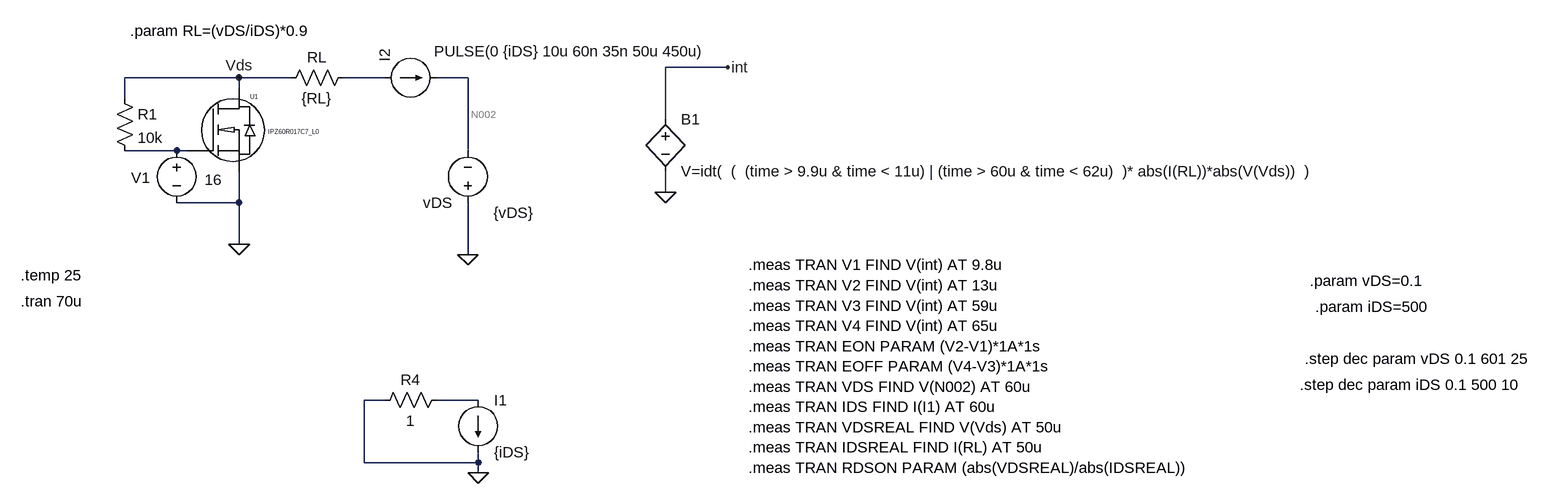
[diagram p0: schematic Eon_Eoff_circuit_reverse.asc]
Eon_Eoff_circuit_reverse.asc, the LTspice schematic file:
Version 4.1
SHEET 1 2248 708
WIRE 976 32 880 32
WIRE 224 48 48 48
WIRE 304 48 224 48
WIRE 448 48 384 48
WIRE 576 48 528 48
WIRE 224 64 224 48
WIRE 48 80 48 48
WIRE 880 112 880 32
WIRE 128 160 48 160
WIRE 144 160 128 160
WIRE 576 160 576 48
WIRE 880 224 880 192
WIRE 224 240 224 192
WIRE 224 240 128 240
WIRE 224 304 224 240
WIRE 576 320 576 240
WIRE 448 544 416 544
WIRE 592 544 528 544
WIRE 416 640 416 544
WIRE 592 640 592 624
WIRE 592 640 416 640
WIRE 592 656 592 640
FLAG 576 320 0
FLAG 224 304 0
FLAG 880 224 0
FLAG 976 32 int
FLAG 592 656 0
FLAG 224 48 Vds
SYMBOL IPx6xx_L1 144 160 R0
SYMATTR InstName U1
SYMATTR Value IPZ60R017C7_L0
SYMBOL voltage 576 256 R180
WINDOW 123 0 0 Left 0
WINDOW 39 0 0 Left 0
WINDOW 3 -101 0 Left 2
SYMATTR Value {vDS}
SYMATTR InstName vDS
SYMBOL res 400 32 R90
WINDOW 0 0 56 VBottom 2
WINDOW 3 32 56 VTop 2
SYMATTR InstName RL
SYMATTR Value {RL}
SYMBOL bv 880 96 R0
SYMATTR InstName B1
SYMATTR Value V=idt(  (  (time > 9.9u & time < 11u) | (time > 60u & time < 62u)  )* abs(I(RL))*abs(V(Vds))  )
SYMBOL current 592 544 R0
WINDOW 123 0 0 Left 0
WINDOW 39 0 0 Left 0
SYMATTR InstName I1
SYMATTR Value {iDS}
SYMBOL res 544 528 R90
WINDOW 0 0 56 VBottom 2
WINDOW 3 32 56 VTop 2
SYMATTR InstName R4
SYMATTR Value 1
SYMBOL res 32 64 R0
SYMATTR InstName R1
SYMATTR Value 10k
SYMBOL voltage 128 144 R0
WINDOW 0 -70 58 Left 2
WINDOW 3 43 61 Left 2
WINDOW 123 0 0 Left 0
WINDOW 39 0 0 Left 0
SYMATTR InstName V1
SYMATTR Value 16
SYMBOL current 448 48 R270
WINDOW 123 0 0 Left 0
WINDOW 39 0 0 Left 0
WINDOW 3 41 76 VRight 2
SYMATTR InstName I2
SYMATTR Value PULSE(0 {iDS} 10u 60n 35n 50u 450u)
TEXT 56 -24 Left 2 !.param RL=(vDS/iDS)*0.9
TEXT 1872 360 Left 2 !.param vDS=0.1
TEXT 1880 400 Left 2 !.param iDS=500
TEXT 1864 480 Left 2 !.step dec param vDS 0.1 601 25
TEXT 1856 520 Left 2 !.step dec param iDS 0.1 500 10
TEXT -112 392 Left 2 !.tran 70u
TEXT 1008 336 Left 2 !.meas TRAN V1 FIND V(int) AT 9.8u\n.meas TRAN V2 FIND V(int) AT 13u\n.meas TRAN V3 FIND V(int) AT 59u\n.meas TRAN V4 FIND V(int) AT 65u\n.meas TRAN EON PARAM (V2-V1)*1A*1s\n.meas TRAN EOFF PARAM (V4-V3)*1A*1s\n.meas TRAN VDS FIND V(N002) AT 60u\n.meas TRAN IDS FIND I(I1) AT 60u\n.meas TRAN VDSREAL FIND V(Vds) AT 50u\n.meas TRAN IDSREAL FIND I(RL) AT 50u\n.meas TRAN RDSON PARAM (abs(VDSREAL)/abs(IDSREAL))
TEXT -112 352 Left 2 !.temp 25

The netlist it stands for:
* Eon_Eoff_circuit_reverse.asc
X§U1 Vds N003 0 IPZ60R017C7_L0  ; pins drain gate source
vDS 0 N002 {vDS}
RL N001 Vds {RL}
B1 int 0 V=idt(  (  (time > 9.9u & time < 11u) | (time > 60u & time < 62u)  )* abs(I(RL))*abs(V(Vds))  )
I1 N004 0 {iDS}
R4 N004 0 1
R1 Vds N003 10k
V1 N003 0 16
I2 N001 N002 PULSE(0 {iDS} 10u 60n 35n 50u 450u)
.param RL=(vDS/iDS)*0.9
.param vDS=0.1
.param iDS=500
.step dec param vDS 0.1 601 25
.step dec param iDS 0.1 500 10
.tran 70u
.meas TRAN V1 FIND V(int) AT 9.8u
.meas TRAN V2 FIND V(int) AT 13u
.meas TRAN V3 FIND V(int) AT 59u
.meas TRAN V4 FIND V(int) AT 65u
.meas TRAN EON PARAM (V2-V1)*1A*1s
.meas TRAN EOFF PARAM (V4-V3)*1A*1s
.meas TRAN VDS FIND V(N002) AT 60u
.meas TRAN IDS FIND I(I1) AT 60u
.meas TRAN VDSREAL FIND V(Vds) AT 50u
.meas TRAN IDSREAL FIND I(RL) AT 50u
.meas TRAN RDSON PARAM (abs(VDSREAL)/abs(IDSREAL))
.temp 25
.lib Infineon_SimulationModel_CoolMOS_C7_MOSFET_600V_Spice.lib
.backanno
.end